# Altium schematic sheet TVS3V3.schdoc
size 49 x 28 mm
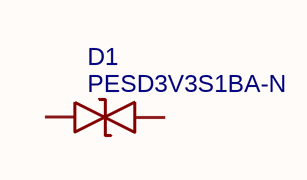
[diagram p0: TVS3V3.schdoc]

## Parts
D1  PESD3V3S1BA-N  [SOD-523_L1.2-W0.8-LS1.6-BI]

## Nets

Not connected (* = marked no-connect by the designer): D1 1 2

## Library data of the parts
D1 = PESD3V3S1BA-N: BOM_Manufacturer: Bourne Semicon (Shenzhen); Contributor: LCSC; BOM_Supplier: LCSC; BOM_Supplier Part: C316037; BOM_Manufacturer Part: PESD3V3S1BA-N; BOM_JLCPCB Part Class: Extended Part; spicePre: D; spiceSymbolName: PESD3V3S1BA-N